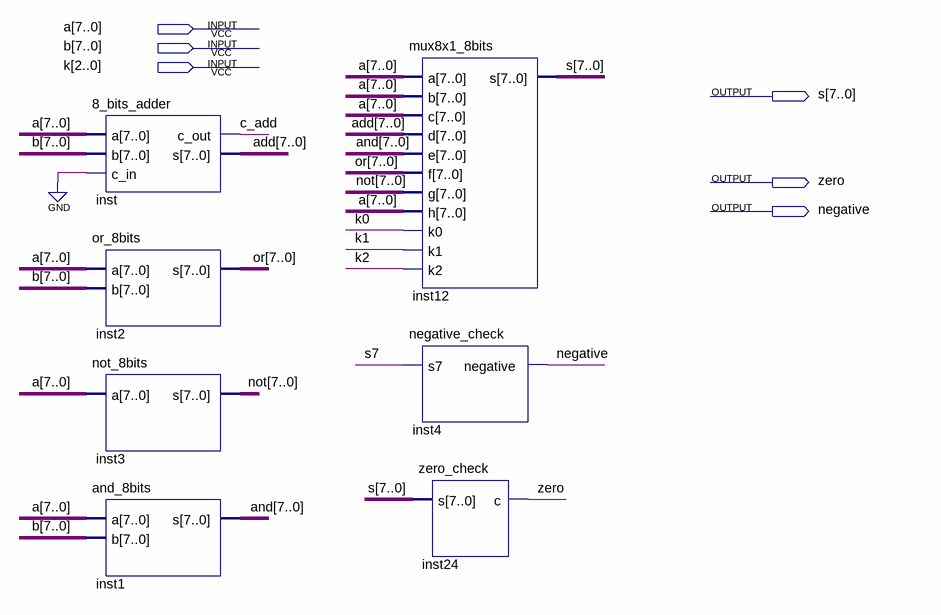
[diagram p0: schematic sheet]
// Quartus schematic neander_alu.bdf as structural Verilog: 7 symbols, 6 pins
module neander_alu (
  input  [7:0] a,
  input  [7:0] b,
  input  [2:0] k,
  output [7:0] s,
  output zero,
  output negative
);

  wire c_add;
  wire [7:0] add, \and , \not , \or ;

  \8_bits_adder  inst (.a(a), .b(b), .c_in(1'b0), .c_out(c_add), .s(add));
  or_8bits inst2 (.a(a), .b(b), .s(\or ));
  not_8bits inst3 (.a(a), .s(\not ));
  and_8bits inst1 (.a(a), .b(b), .s(\and ));
  mux8x1_8bits inst12 (
    .a(a), .b(a), .c(a), .d(add), .e(\and ), .f(\or ), .g(\not ), .h(a), .k0(k[0]), .k1(k[1]), .k2(k[2]),
    .s(s));
  negative_check inst4 (.s7(s[7]), .negative(negative));
  zero_check inst24 (.s(s), .c(zero));
endmodule
